# Altium schematic sheet heater_control.SchDoc: Heater Control
size Tabloid; DocumentNumber: LM-003; Revision: C; SheetNumber: 3; SheetTotal: 4
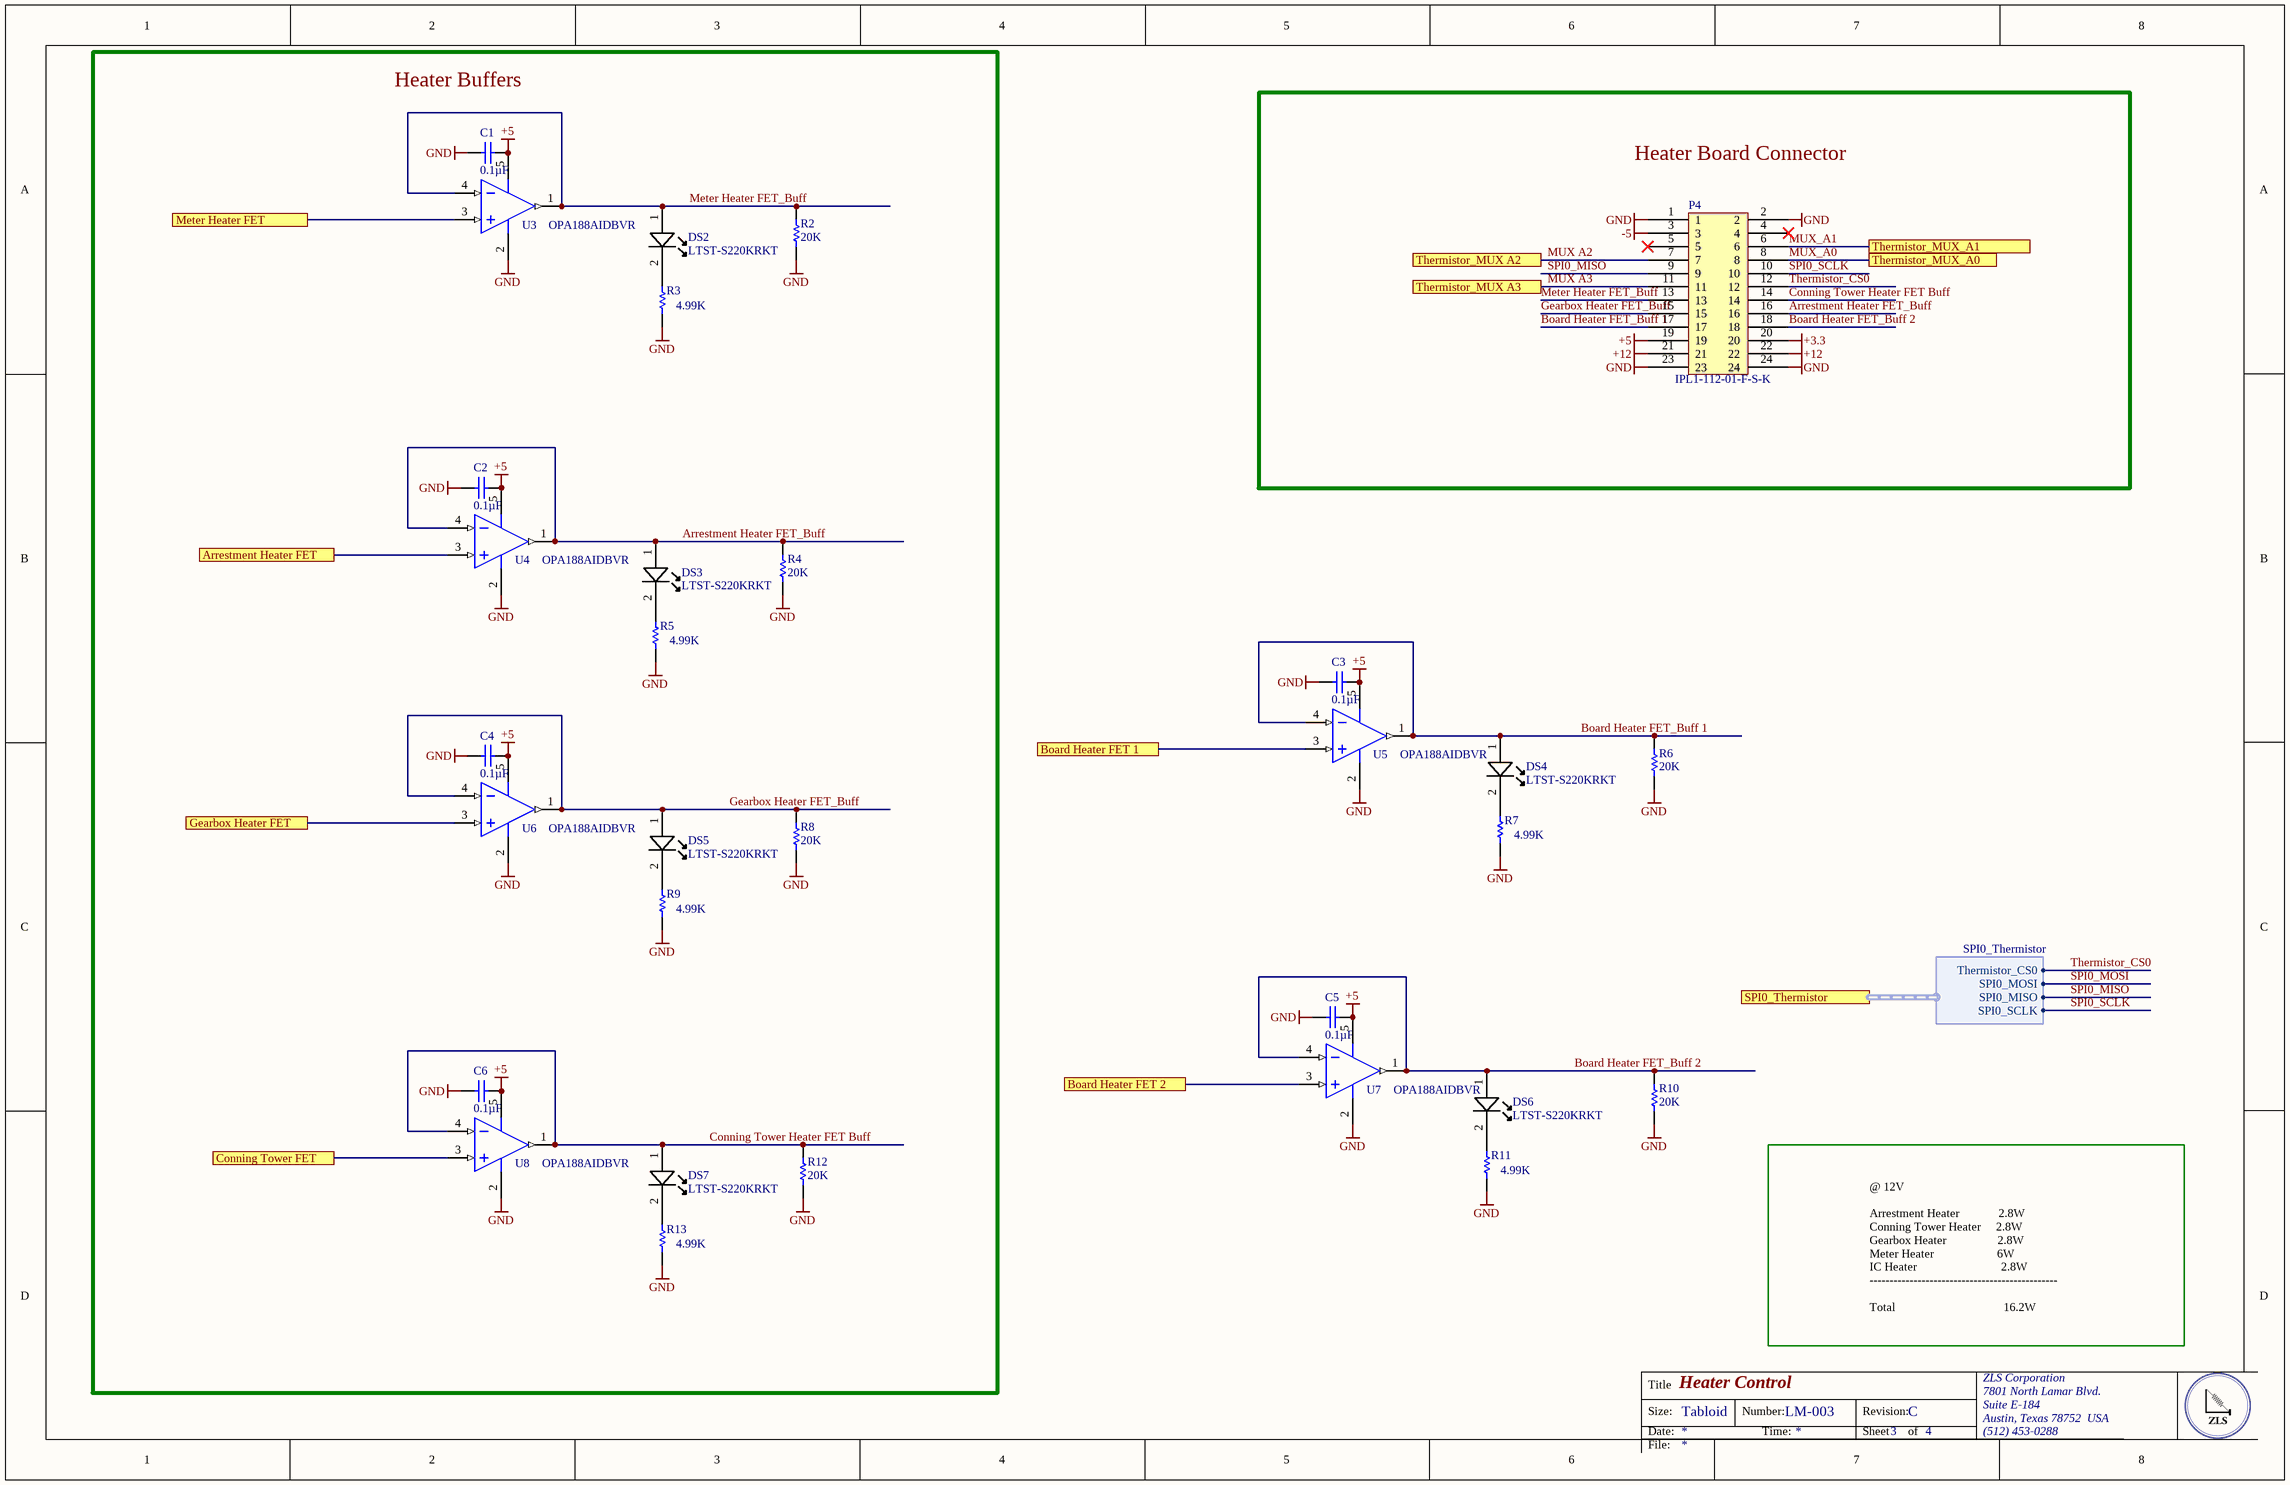
[diagram p0: heater_control.SchDoc]

## Parts
C1  Capacitance: 0.1µF  [CAPC0805(2012)145_N]  (hidden comment: CAP CER 0.1UF 25V X7R 0805)
C2  Capacitance: 0.1µF  [CAPC0805(2012)145_N]  (hidden comment: CAP CER 0.1UF 25V X7R 0805)
C3  Capacitance: 0.1µF  [CAPC0805(2012)145_N]  (hidden comment: CAP CER 0.1UF 25V X7R 0805)
C4  Capacitance: 0.1µF  [CAPC0805(2012)145_N]  (hidden comment: CAP CER 0.1UF 25V X7R 0805)
C5  Capacitance: 0.1µF  [CAPC0805(2012)145_N]  (hidden comment: CAP CER 0.1UF 25V X7R 0805)
C6  Capacitance: 0.1µF  [CAPC0805(2012)145_N]  (hidden comment: CAP CER 0.1UF 25V X7R 0805)
DS2  Manufacturer Part Number: LTST-S220KRKT  [0805C_L]  (hidden comment: Visible Name Value Type    False Description Lite-On LTST-S220KRKT Red LED, 631 nm 2012 (0805) Side View, Rectangle Lens SMD package STRING)
DS3  Manufacturer Part Number: LTST-S220KRKT  [0805C_L]  (hidden comment: Visible Name Value Type    False Description Lite-On LTST-S220KRKT Red LED, 631 nm 2012 (0805) Side View, Rectangle Lens SMD package STRING)
DS4  Manufacturer Part Number: LTST-S220KRKT  [0805C_L]  (hidden comment: Visible Name Value Type    False Description Lite-On LTST-S220KRKT Red LED, 631 nm 2012 (0805) Side View, Rectangle Lens SMD package STRING)
DS5  Manufacturer Part Number: LTST-S220KRKT  [0805C_L]  (hidden comment: Visible Name Value Type    False Description Lite-On LTST-S220KRKT Red LED, 631 nm 2012 (0805) Side View, Rectangle Lens SMD package STRING)
DS6  Manufacturer Part Number: LTST-S220KRKT  [0805C_L]  (hidden comment: Visible Name Value Type    False Description Lite-On LTST-S220KRKT Red LED, 631 nm 2012 (0805) Side View, Rectangle Lens SMD package STRING)
DS7  Manufacturer Part Number: LTST-S220KRKT  [0805C_L]  (hidden comment: Visible Name Value Type    False Description Lite-On LTST-S220KRKT Red LED, 631 nm 2012 (0805) Side View, Rectangle Lens SMD package STRING)
P4  IPL1-112-01-F-S-K  [IPL1-112-01-F-S-K]
R2  20K  [RESC0805(2012)_L]
R3  4.99K  [RESC0805(2012)_L]
R4  20K  [RESC0805(2012)_L]
R5  4.99K  [RESC0805(2012)_L]
R6  20K  [RESC0805(2012)_L]
R7  4.99K  [RESC0805(2012)_L]
R8  20K  [RESC0805(2012)_L]
R9  4.99K  [RESC0805(2012)_L]
R10  20K  [RESC0805(2012)_L]
R11  4.99K  [RESC0805(2012)_L]
R12  20K  [RESC0805(2012)_L]
R13  4.99K  [RESC0805(2012)_L]
U3  OPA188AIDBVR  [DBV0005A_M]
U4  OPA188AIDBVR  [DBV0005A_M]
U5  OPA188AIDBVR  [DBV0005A_M]
U6  OPA188AIDBVR  [DBV0005A_M]
U7  OPA188AIDBVR  [DBV0005A_M]
U8  OPA188AIDBVR  [DBV0005A_M]

## Blocks framed on the sheet
Heater Buffers: C1 C2 C4 C6 DS2 DS3 DS5 DS7 R2-R5 R8 R9 R12 R13 U3 U4 U6 U8
Heater Board Connector: P4

## Ports
Arrestment Heater FET, Board Heater FET 1, Board Heater FET 2, Conning Tower FET, Gearbox Heater FET, Meter Heater FET, SPI0_Thermistor (harness SPI0_Thermistor), Thermistor_MUX A2, Thermistor_MUX A3, Thermistor_MUX_A0, Thermistor_MUX_A1

## Harnesses
SPI0_Thermistor: Thermistor_CS0, SPI0_MOSI, SPI0_MISO, SPI0_SCLK

## Nets
+3.3: P4.20
+5: C1.2 C2.2 C3.2 C4.2 C5.2 C6.2 P4.19 U3.5(V+) U4.5(V+) U5.5(V+) U6.5(V+) U7.5(V+) U8.5(V+)
+12: P4.21 P4.22
-5: P4.3
GND: C1.1 C2.1 C3.1 C4.1 C5.1 C6.1 P4.1 P4.2 P4.23 P4.24 R2.2 R3.2 R4.2 R5.2 R6.2 R7.2 R8.2 R9.2 R10.2 R11.2 R12.2 R13.2 U3.2(V-) U4.2(V-) U5.2(V-) U6.2(V-) U7.2(V-) U8.2(V-)
Arrestment Heater FET: U4.3(IN+) ; port Arrestment Heater FET
Arrestment Heater FET_Buff: DS3.1(A) P4.16 R4.1 U4.1(OUT) U4.4(IN-)
Board Heater FET 1: U5.3(IN+) ; port Board Heater FET 1
Board Heater FET 2: U7.3(IN+) ; port Board Heater FET 2
Board Heater FET_Buff 1: DS4.1(A) P4.17 R6.1 U5.1(OUT) U5.4(IN-)
Board Heater FET_Buff 2: DS6.1(A) P4.18 R10.1 U7.1(OUT) U7.4(IN-)
Conning Tower FET: U8.3(IN+) ; port Conning Tower FET
Conning Tower Heater FET Buff: DS7.1(A) P4.14 R12.1 U8.1(OUT) U8.4(IN-)
Gearbox Heater FET: U6.3(IN+) ; port Gearbox Heater FET
Gearbox Heater FET_Buff: DS5.1(A) P4.15 R8.1 U6.1(OUT) U6.4(IN-)
Meter Heater FET: U3.3(IN+) ; port Meter Heater FET
Meter Heater FET_Buff: DS2.1(A) P4.13 R2.1 U3.1(OUT) U3.4(IN-)
MUX A2: P4.7 ; port Thermistor_MUX A2
MUX A3: P4.11 ; port Thermistor_MUX A3
MUX_A0: P4.8 ; port Thermistor_MUX_A0
MUX_A1: P4.6 ; port Thermistor_MUX_A1
SPI0_MISO: P4.9 ; port SPI0_Thermistor.SPI0_MISO
SPI0_MOSI: port SPI0_Thermistor.SPI0_MOSI
SPI0_SCLK: P4.10 ; port SPI0_Thermistor.SPI0_SCLK
Thermistor_CS0: P4.12 ; port SPI0_Thermistor.Thermistor_CS0
NetDS2_2: DS2.2(K) R3.1
NetDS3_2: DS3.2(K) R5.1
NetDS4_2: DS4.2(K) R7.1
NetDS5_2: DS5.2(K) R9.1
NetDS6_2: DS6.2(K) R11.1
NetDS7_2: DS7.2(K) R13.1

Not connected (* = marked no-connect by the designer): P4 4* 5*

## Notes on the sheet
- @ 12V
  Arrestment Heater             2.8W
  Conning Tower Heater     2.8W
  Gearbox Heater                 2.8W
  Meter Heater                     6W
  IC Heater                            2.8W
  -----------------------------------------------
  Total                                    16.2W
- Title
- Size:
- Date:
- Tabloid
- Number:
- Time:
- Revision:
- Sheet
- of
- ZLS Corporation
- 7801 North Lamar Blvd.
- Suite E-184
- Austin, Texas 78752  USA
- (512) 453-0288
- File:

## Library data of the parts
C1-C6 = CMP-1036-04795-1: Manufacturer: Murata Electronics North America; Manufacturer Part Number: GRM21BR71E104KA01L; Tolerance: ±10%; Supplier 1: Digi-Key; Supplier Part Number 1: 490-1673-6-ND; RoHS: RoHS Compliant; Category: Capacitors; Stock 1: 891652; Pricing 1: 1=0.2, 10=0.145, 100=0.0683, 500=0.04788, 1000=0.03964 (USD); Packaging: Digi-Reel®; Part Status: Active; Voltage - Rated: 25V; Temperature Coefficient: X7R; Operating Temperature: -55°C ~ 125°C; Features: -; Ratings: -; Applications: General Purpose; Mounting Type: Surface Mount, MLCC; Package / Case: 0805 (2012 Metric); Size / Dimension: 0.079" L x 0.049" W (2.00mm x 1.25mm); Height - Seated (Max): -; Thickness (Max): 0.053" (1.35mm); Lead Spacing: -; Lead Style: -; ComponentLink1URL: http://www.murata.com/~/media/webrenewal/support/library/catalog/products/capacitor/mlcc/c02e.ashx; ComponentLink1Description: http://www.murata.com/~/media/webrenewal/support/library/catalog/products/capacitor/mlcc/c02e.ashx
DS2-DS7 = LED A/K: Manufacturer: Vishay / Lite-On; Lens Colour: Colorless; Lens Style: Diffused,Colorless; Viewing Angle: 130°; Luminous Intensity: 54mcd; Forward Current: 20mA; Forward Voltage: 2V; Power Rating: 75mW; Dominant Wavelength: 631nm; Lens Transparency: Clear; Number of Elements: 1; Wavelength: 639nm; Supplier 1: Digi-Key; Supplier Part Number 1: 160-1469-1-ND; Stock 1: 108191; Pricing 1: 1=0.31, 10=0.225, 25=0.1656, 100=0.1183, 250=0.0804, 500=0.071, 1000=0.0556 (USD); Mount: Surface Mount; Case/Package: 0805; Number of Pins: 2; Colour: Red; Case Code (Metric): 2012; Case Code (Imperial): 0805; Min Operating Temperature: -55°C; Max Operating Temperature: 85°C; Packaging: Tape and Reel; Package Quantity: 4000; Illumination Colour: Red; Test Current: 20mA; Power Dissipation: 75mW; Number of LEDs: 1; Length: 2.1mm; Height: 0.6mm; Width: 1mm; Depth: 0.6mm; Radiation Hardening: No; Lead Free: Lead Free; ComponentLink1URL: https://datasheet.ciiva.com/2110/s-110-ltst-s220krkt-2110132.pdf; ComponentLink1Description: https://datasheet.ciiva.com/2110/s-110-ltst-s220krkt-2110132.pdf; ComponentLink2URL: https://datasheet.ciiva.com/2110/s-110-ltst-s220krkt-2110133.pdf; ComponentLink2Description: https://datasheet.ciiva.com/2110/s-110-ltst-s220krkt-2110133.pdf; ComponentLink3URL: https://datasheet.ciiva.com/2110/s-110-ltst-s220krkt-2110134.pdf; ComponentLink3Description: https://datasheet.ciiva.com/2110/s-110-ltst-s220krkt-2110134.pdf; ComponentLink4URL: https://datasheet.ciiva.com/12403/lite-on-ltst-s220krkt-187389-12403798.pdf; ComponentLink4Description: https://datasheet.ciiva.com/12403/lite-on-ltst-s220krkt-187389-12403798.pdf; ComponentLink5URL: https://datasheet.ciiva.com/16345/lite-onltst-s220krkt-16345511.pdf; ComponentLink5Description: https://datasheet.ciiva.com/16345/lite-onltst-s220krkt-16345511.pdf; ComponentLink6URL: https://datasheet.ciiva.com/15118/getdatasheetpartid-225752-15118120.pdf; ComponentLink6Description: https://datasheet.ciiva.com/15118/getdatasheetpartid-225752-15118120.pdf; ComponentLink7URL: https://datasheet.ciiva.com/14633/0900766b80dc0b76-14633737.pdf; ComponentLink7Description: https://datasheet.ciiva.com/14633/0900766b80dc0b76-14633737.pdf; ComponentLink8URL: https://datasheet.ciiva.com/11775/0900766b80dc0b76-11775439.pdf; ComponentLink8Description: https://datasheet.ciiva.com/11775/0900766b80dc0b76-11775439.pdf
P4 = IPL1-112-01-F-S-K: IPL1-112-01-F-D-K; Manufacturer: Samtec Inc.; Supplier 1: Digi-Key; Supplier Part Number 1: IPL1-112-01-F-S-K-ND; Manufacturer Part Number: IPL1-112-01-F-S-K; RoHS: RoHS Compliant; Category: Connectors, Interconnects; Stock 1: 0; Pricing 1: 1=2.63 (USD); Part Status: Active
R2 R4 R6 R8 R10 R12 = CMP-1013-00215-1: RES SMD 20K OHM 1% 1/8W 0805; Manufacturer: Panasonic Electronic Components; Manufacturer Part Number: ERJ-6ENF2002V; Power (Watts): 0.125W, 1/8W; Temperature Coefficient: ±100ppm/°C; Supplier 1: Digi-Key; Supplier Part Number 1: P20.0KCCT-ND; RoHS: RoHS Compliant; Category: Resistors; Stock 1: 269698; Pricing 1: 1=0.11, 10=0.1, 100=0.0385, 1000=0.01695, 2500=0.01464 (USD); Packaging: Cut Tape (CT); Part Status: Active; Tolerance: ±1%; Composition: Thick Film; Features: Automotive AEC-Q200; Operating Temperature: -55°C ~ 155°C; Package / Case: 0805 (2012 Metric); Supplier Device Package: 0805; Size / Dimension: 0.079" L x 0.049" W (2.00mm x 1.25mm); Height - Seated (Max): 0.028" (0.70mm); Failure Rate: -; ComponentLink1URL: https://industrial.panasonic.com/cdbs/www-data/pdf/RDA0000/AOA0000C304.pdf; ComponentLink1Description: https://industrial.panasonic.com/cdbs/www-data/pdf/RDA0000/AOA0000C304.pdf
R3 R5 R7 R9 R11 R13 = CMP-1013-00215-1: RES SMD 4.99K OHM 1% 1/8W 0805; Manufacturer: Panasonic Electronic Components; Manufacturer Part Number: ERJ-6ENF4991V; Power (Watts): 0.125W, 1/8W; Temperature Coefficient: ±100ppm/°C; Supplier 1: Digi-Key; Supplier Part Number 1: P4.99KCCT-ND; RoHS: RoHS Compliant; Category: Resistors; Stock 1: 1015773; Pricing 1: 1=0.11, 10=0.1, 100=0.0385, 1000=0.01695, 2500=0.01464 (USD); Packaging: Cut Tape (CT); Part Status: Active; Tolerance: ±1%; Composition: Thick Film; Features: Automotive AEC-Q200; Operating Temperature: -55°C ~ 155°C; Package / Case: 0805 (2012 Metric); Supplier Device Package: 0805; Size / Dimension: 0.079" L x 0.049" W (2.00mm x 1.25mm); Height - Seated (Max): 0.028" (0.70mm); Failure Rate: -; ComponentLink1URL: https://industrial.panasonic.com/cdbs/www-data/pdf/RDA0000/AOA0000C304.pdf; ComponentLink1Description: https://industrial.panasonic.com/cdbs/www-data/pdf/RDA0000/AOA0000C304.pdf
U3-U8 = CMP-0809-00005-2: Precision, Low Noise, Rail-to-Rail Output, Zero-Drift Operational Amplifier, 4 to 36 V, -40 to 125 degC, 5-pin SOT23 (DBV5), Green (RoHS & no Sb/Br); Manufacturer: Texas Instruments; Slew Rate: 0.8 V/µs; Current - Supply: 450µA; Voltage - Supply, Single/Dual (±): 4 V ~ 36 V, ±2 V ~ 18 V; Supplier 1: Digi-Key; Supplier Part Number 1: 296-40438-1-ND; Manufacturer Part Number: OPA188AIDBVR; RoHS: RoHS Compliant; Category: Integrated Circuits (ICs); Stock 1: 1779; Pricing 1: 1=2.46, 10=2.211, 100=1.7771, 500=1.46002, 1000=1.20974 (USD); Packaging: Cut Tape (CT); Part Status: Active; Amplifier Type: Zero-Drift; Output Type: Rail-to-Rail; Operating Temperature: -40°C ~ 125°C; Mounting Type: Surface Mount; Package / Case: SC-74A, SOT-753; Supplier Device Package: SOT-23-5; ComponentLink1URL: http://www.ti.com/lit/ds/symlink/opa188.pdf; ComponentLink1Description: http://www.ti.com/lit/ds/symlink/opa188.pdf